# EAGLE schematic EL Driver (EAGLE 7.7.0)
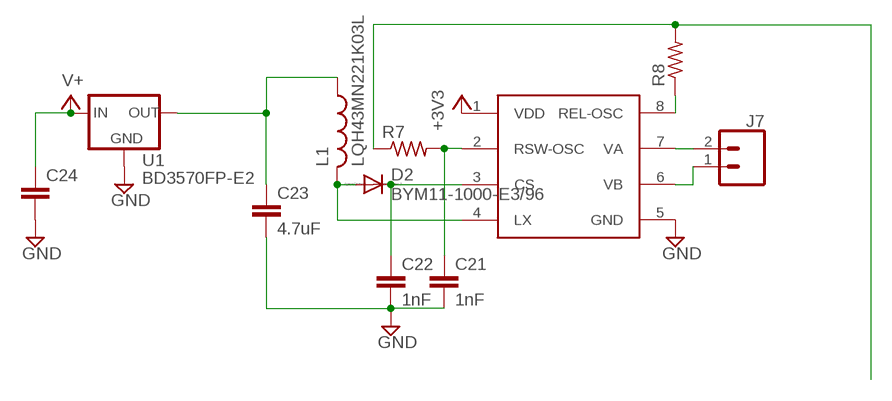
[diagram p0: schematic, sheet 1]

## Parts
C21  1nF  C-EUC1206  [C1206]
C22  1nF  C-EUC1206  [C1206]
C23  4.7uF  C-EUC1206  [C1206]
C24  C-EUC1206  [C1206]
D2  BYM11-1000-E3/96  DIODE-MELF-MLL41  [MELF-MLL41]
J7  CONN_02  [1X02]
L1  LQH43MN221K03L  L-USL1812  [L1812]
R7  R-US_R1206  [R1206]
R8  R-US_R1206  [R1206]
U1  BD3570FP-E2  V_REG_78XX7812  [TO-252]
U$3  HV830  [SOIC8]

## Nets
+3V3: U$3.1(VDD)
GND: C21.2 C22.2 C23.2 C24.2 U1.3(GND) U$3.5(GND)
N$46: J7.2 U$3.7(VA)
N$47: J7.1 U$3.6(VB)
N$48: C22.1 D2.C U$3.3(CS)
N$49: D2.A L1.2 U$3.4(LX)
N$50: C21.1 R7.2 U$3.2(RSW-OSC)
N$51: R8.1 U$3.8(REL-OSC)
N$52: R7.1 R8.2
N$53: C23.1 L1.1 U1.2(OUT)
V+: C24.1 U1.1(IN)

## Library data of the parts
C21-C24 = resistor:C-EU: CAPACITOR, European symbol
D2 = diode:DIODE-: DIODE
J7 = SparkFun-Connectors:CONN_02: Multi connection point. Often used as Generic Header-pin footprint for 0.1 inch spaced/style header connections On any of the 0.1 inch spaced packages, you can populate with these: Break Away Headers - Straight <https://www.sparkfun.com/products/116> (PRT-00116) Break Away Male Headers - Right Angle <https://www.sparkfun.com/products/553> (PRT-00553) Female Headers <https://www.sparkfun.com/products/115> (PRT-00115) Break Away Headers - Machine Pin <https://www.sparkfun.com/products/117> (PRT-00117) Break Away Female Headers - Swiss Machine Pin <https://www.sparkfun.com/products/743> (PRT-00743) For SCREWTERMINALS and SPRING TERMINALS visit here: Screw Terimnals on SparkFun.com <https://www.sparkfun.com/search/results?term=Screw+Terminals> (5mm/3.5mm/2.54mm spacing) This device is also useful as a general connection point to wire up your design to another part of your project. Our various solder wires solder well into these plated through hole pads. Hook-Up Wire - Assortment (Stranded, 22 AWG) <https://www.sparkfun.com/products/11375> (PRT-11375) Hook-Up Wire - Assortment (Solid Core, 22 AWG) <https://www.sparkfun.com/products/11367> (PRT-11367) View the entire wire category on our website here <https://www.sparkfun.com/categories/141> Special notes: Molex polarized connector foot print use with: PRT-08233 with associated crimp pins and housings. 2.54_SCREWTERM for use with PRT-10571. 3.5mm Screw Terminal footprints for PRT-08084 5mm Screw Terminal footprints for use with PRT-08432
L1 = resistor:L-US: INDUCTOR, American symbol
R7 R8 = resistor:R-US_: RESISTOR, American symbol
U1 = SparkFun-IC-Power:V_REG_78XX: Voltage Regulator Standard 78xx regulator. IGO (Input Ground Output). Spark Fun Electronics SKU : COM-00107; PROD_ID: VREG-12370; VALUE: +12v
U$3 = FRC696:HV830